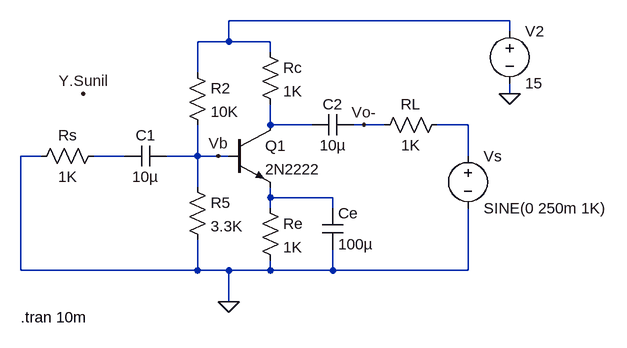
[diagram p0: schematic Run4_Lab1.asc]
Run4_Lab1.asc, the LTspice schematic file:
Version 4
SHEET 1 880 680
WIRE 288 -176 -144 -176
WIRE 288 -160 288 -176
WIRE -144 -144 -144 -176
WIRE -144 -144 -192 -144
WIRE -80 -144 -144 -144
WIRE -80 -128 -80 -144
WIRE -192 -96 -192 -144
WIRE 288 -64 288 -80
WIRE -80 -16 -80 -48
WIRE -16 -16 -80 -16
WIRE 64 -16 48 -16
WIRE 96 -16 64 -16
WIRE 224 -16 176 -16
WIRE -432 32 -464 32
WIRE -304 32 -352 32
WIRE -192 32 -192 -16
WIRE -192 32 -240 32
WIRE -160 32 -192 32
WIRE -144 32 -160 32
WIRE 224 32 224 -16
WIRE -192 80 -192 32
WIRE -80 96 -80 80
WIRE 16 96 -80 96
WIRE -80 112 -80 96
WIRE 16 112 16 96
WIRE -464 208 -464 32
WIRE -192 208 -192 160
WIRE -192 208 -464 208
WIRE -144 208 -192 208
WIRE -80 208 -80 192
WIRE -80 208 -144 208
WIRE 16 208 16 176
WIRE 16 208 -80 208
WIRE 224 208 224 112
WIRE 224 208 16 208
WIRE -144 256 -144 208
FLAG 288 -64 0
FLAG -144 256 0
FLAG 64 -16 Vo-
FLAG -160 32 Vb
FLAG -368 -64 Y.Sunil
SYMBOL res -336 16 R90
WINDOW 0 0 56 VBottom 2
WINDOW 3 32 56 VTop 2
SYMATTR InstName Rs
SYMATTR Value 1K
SYMBOL cap -240 16 R90
WINDOW 0 0 32 VBottom 2
WINDOW 3 32 32 VTop 2
SYMATTR InstName C1
SYMATTR Value 10µ
SYMBOL res -208 -112 R0
SYMATTR InstName R2
SYMATTR Value 10K
SYMBOL res -96 -144 R0
SYMATTR InstName Rc
SYMATTR Value 1K
SYMBOL cap 48 -32 R90
WINDOW 0 0 32 VBottom 2
WINDOW 3 32 32 VTop 2
SYMATTR InstName C2
SYMATTR Value 10µ
SYMBOL res 192 -32 R90
WINDOW 0 0 56 VBottom 2
WINDOW 3 32 56 VTop 2
SYMATTR InstName RL
SYMATTR Value 1K
SYMBOL voltage 224 16 R0
WINDOW 123 0 0 Left 0
WINDOW 39 0 0 Left 0
SYMATTR InstName Vs
SYMATTR Value SINE(0 250m 1K)
SYMBOL res -208 64 R0
SYMATTR InstName R5
SYMATTR Value 3.3K
SYMBOL npn -144 -16 R0
SYMATTR InstName Q1
SYMATTR Value 2N2222
SYMBOL res -96 96 R0
SYMATTR InstName Re
SYMATTR Value 1K
SYMBOL cap 0 112 R0
SYMATTR InstName Ce
SYMATTR Value 100µ
SYMBOL voltage 288 -176 R0
SYMATTR InstName V2
SYMATTR Value 15
TEXT -464 280 Left 2 !.tran 10m

The netlist it stands for:
* Run4_Lab1.asc
Rs N004 0 1K
C1 Vb N004 10µ
R2 N001 Vb 10K
Rc N001 N002 1K
C2 Vo- N002 10µ
RL N003 Vo- 1K
Vs N003 0 SINE(0 250m 1K)
R5 Vb 0 3.3K
Q1 N002 Vb N005 0 2N2222
Re N005 0 1K
Ce N005 0 100µ
V2 N001 0 15
.model NPN NPN
.model PNP PNP
.lib standard.bjt
.tran 10m
.backanno
.end